# EAGLE design rgbwa_controller (EAGLE 7.1.0)
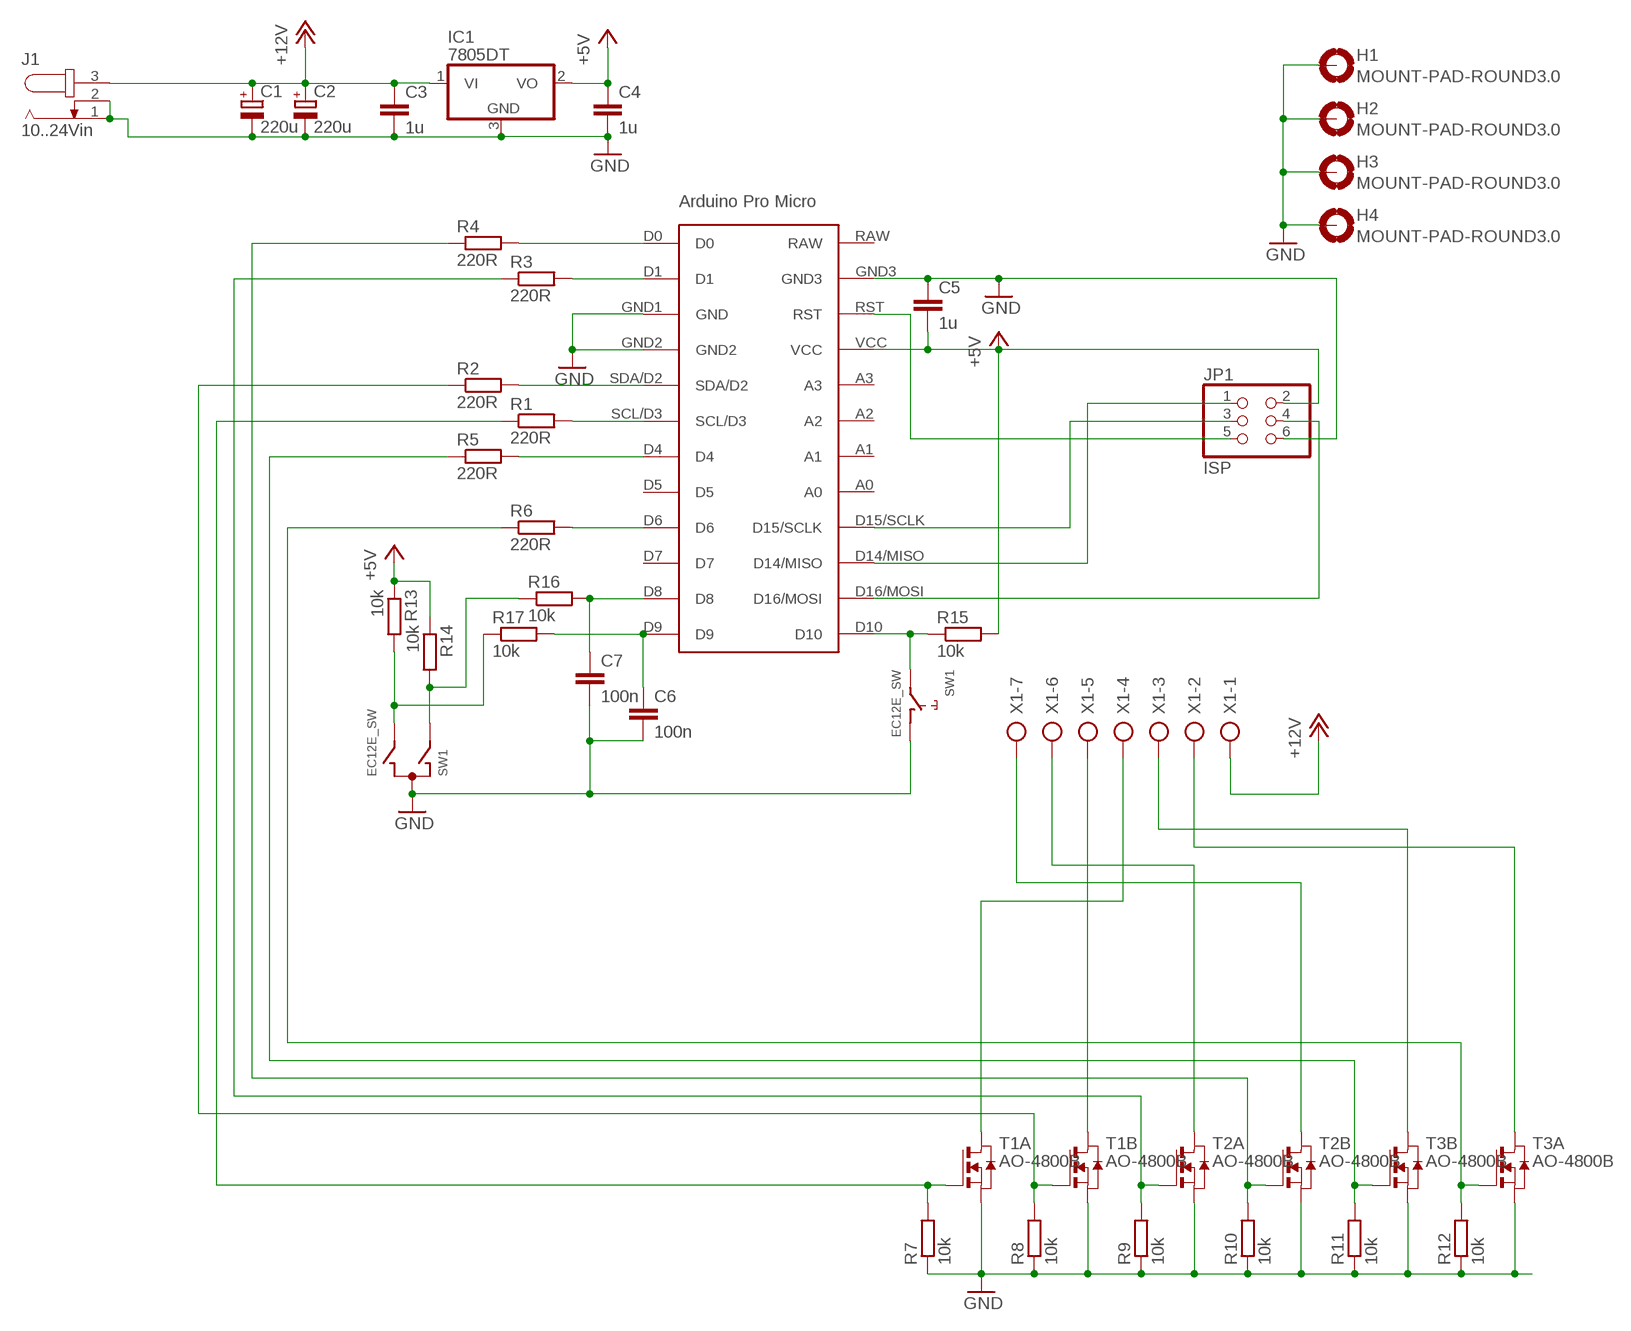
[diagram p0: schematic, sheet 1]

## Parts
C1  220u  CPOL-EU150CLZ-1010  [150CLZ-1010]
C2  220u  CPOL-EU150CLZ-1010  [150CLZ-1010]
C3  1u  C-EUC1206  [C1206]
C4  1u  C-EUC1206  [C1206]
C5  1u  C-EUC1206  [C1206]
C6  100n  C-EUC0805  [C0805]
C7  100n  C-EUC0805  [C0805]
H1  MOUNT-PAD-ROUND3.0  [3,0-PAD]
H2  MOUNT-PAD-ROUND3.0  [3,0-PAD]
H3  MOUNT-PAD-ROUND3.0  [3,0-PAD]
H4  MOUNT-PAD-ROUND3.0  [3,0-PAD]
IC1  7805DT  [TO252]
J1  10..24Vin  JACK-PLUG1  [SPC4078]
JP1  ISP  PINHD-2X3  [2X03]
R1  220R  R-EU_M0805  [M0805]
R2  220R  R-EU_M0805  [M0805]
R3  220R  R-EU_M0805  [M0805]
R4  220R  R-EU_M0805  [M0805]
R5  220R  R-EU_M0805  [M0805]
R6  220R  R-EU_M0805  [M0805]
R7  10k  R-EU_M0805  [M0805]
R8  10k  R-EU_M0805  [M0805]
R9  10k  R-EU_M0805  [M0805]
R10  10k  R-EU_M0805  [M0805]
R11  10k  R-EU_M0805  [M0805]
R12  10k  R-EU_M0805  [M0805]
R13  10k  R-EU_M0805  [M0805]
R14  10k  R-EU_M0805  [M0805]
R15  10k  R-EU_M0805  [M0805]
R16  10k  R-EU_M0805  [M0805]
R17  10k  R-EU_M0805  [M0805]
SW1  EC12E_SW  [ALPS_EC12E_SW]
T1  AO-4800B  NMOS2SM8  [SM8]
T2  AO-4800B  NMOS2SM8  [SM8]
T3  AO-4800B  NMOS2SM8  [SM8]
U$1  PROMICRO  [PROMICRO]
X1  AK300/7  [AK300/7]

## Nets
+5V: C4.1 C5.2 IC1.2(VO) JP1.2 R13.1 R14.1 R15.2 U$1.VCC
+12V: C1.+ C2.+ C3.1 IC1.1(VI) J1.3 X1.1
GND: C1.- C2.- C3.2 C4.2 C5.1 C6.2 C7.2 H1.B3,0(MOUNT) H2.B3,0(MOUNT) H3.B3,0(MOUNT) H4.B3,0(MOUNT) IC1.3(GND) J1.1 J1.2 JP1.6 R7.1 R8.1 R9.1 R10.1 R11.1 R12.1 SW1.C SW1.D T1.1(A:S) T1.3(B:S) T2.1(A:S) T2.3(B:S) T3.1(A:S) T3.3(B:S) U$1.GND1(GND) U$1.GND2 U$1.GND3
N$1: R4.2 U$1.D0
N$2: R3.2 U$1.D1
N$3: R2.2 U$1.SDA/D2
N$4: R1.2 U$1.SCL/D3
N$5: R5.2 U$1.D4
N$6: R6.2 U$1.D6
N$7: R1.1 R7.2 T1.2(A:G)
N$8: R2.1 R8.2 T1.4(B:G)
N$9: R3.1 R9.2 T2.2(A:G)
N$10: R4.1 R10.2 T2.4(B:G)
N$11: R5.1 R11.2 T3.4(B:G)
N$12: R6.1 R12.2 T3.2(A:G)
N$13: R13.2 R17.1 SW1.B
N$14: JP1.1 U$1.D14/MISO
N$15: T3.7(A:D) T3.8(A:D) X1.2
N$16: T1.5(B:D) T1.6(B:D) X1.5
N$17: T1.7(A:D) T1.8(A:D) X1.4
N$20: R14.2 R16.1 SW1.A
N$21: JP1.3 U$1.D15/SCLK
N$22: C6.1 R17.2 U$1.D9
N$23: R15.1 SW1.E U$1.D10
N$24: C7.1 R16.2 U$1.D8
N$25: JP1.5 U$1.RST
N$26: T3.5(B:D) T3.6(B:D) X1.3
N$27: T2.5(B:D) T2.6(B:D) X1.7
N$28: T2.7(A:D) T2.8(A:D) X1.6
N$29: JP1.4 U$1.D16/MOSI
Unconnected: SW1.GND1(G) SW1.GND2(G) U$1.A0 U$1.A1 U$1.A2 U$1.A3 U$1.D5 U$1.D7 U$1.RAW

## Library data of the parts
C1 C2 = rcl:CPOL-EU: POLARIZED CAPACITOR, European symbol
C3-C7 = rcl:C-EU: CAPACITOR, European symbol
H1-H4 = holes:MOUNT-PAD-ROUND: MOUNTING PAD, round
IC1 = linear:78*: Positive VOLTAGE REGULATOR Source: http://cache.national.com/ds/LM/LM78L05.pdf http://www.fairchildsemi.com/ds/LM/LM7805.pdf
J1 = con-jack:JACK-PLUG: DC POWER JACK Power Jack, DC, Right Angle, Through Hole, Rated 5A at 16VDC, PC Terminals Distributor: Farnell (www.Farnell.de) Drawing: 84N1161.pdf / 84N1162.pdf Manufacturer: SPC Technology (www.spctechnology.com) Type: SPC4077 / SPC 4078; OC_FARNELL: unknown; OC_NEWARK: unknown
JP1 = pinhead:PINHD-2X3: PIN HEADER
R1-R17 = rcl:R-EU_: RESISTOR, European symbol
SW1 = switch-alps:EC12E_SW: ALPS rotary Encoder EC12E series with switch; MPN: EC12E2424407; OC_FARNELL: 1520813; OC_NEWARK: 74M1068
T1-T3 = zetex:NMOS2SM8: Dual MOS FET; OC_FARNELL: unknown; OC_NEWARK: unknown
U$1 = arduino pro micro:PROMICRO
X1 = con-ptr500:AK300/7: CONNECTOR; OC_FARNELL: unknown; OC_NEWARK: unknown

## Board
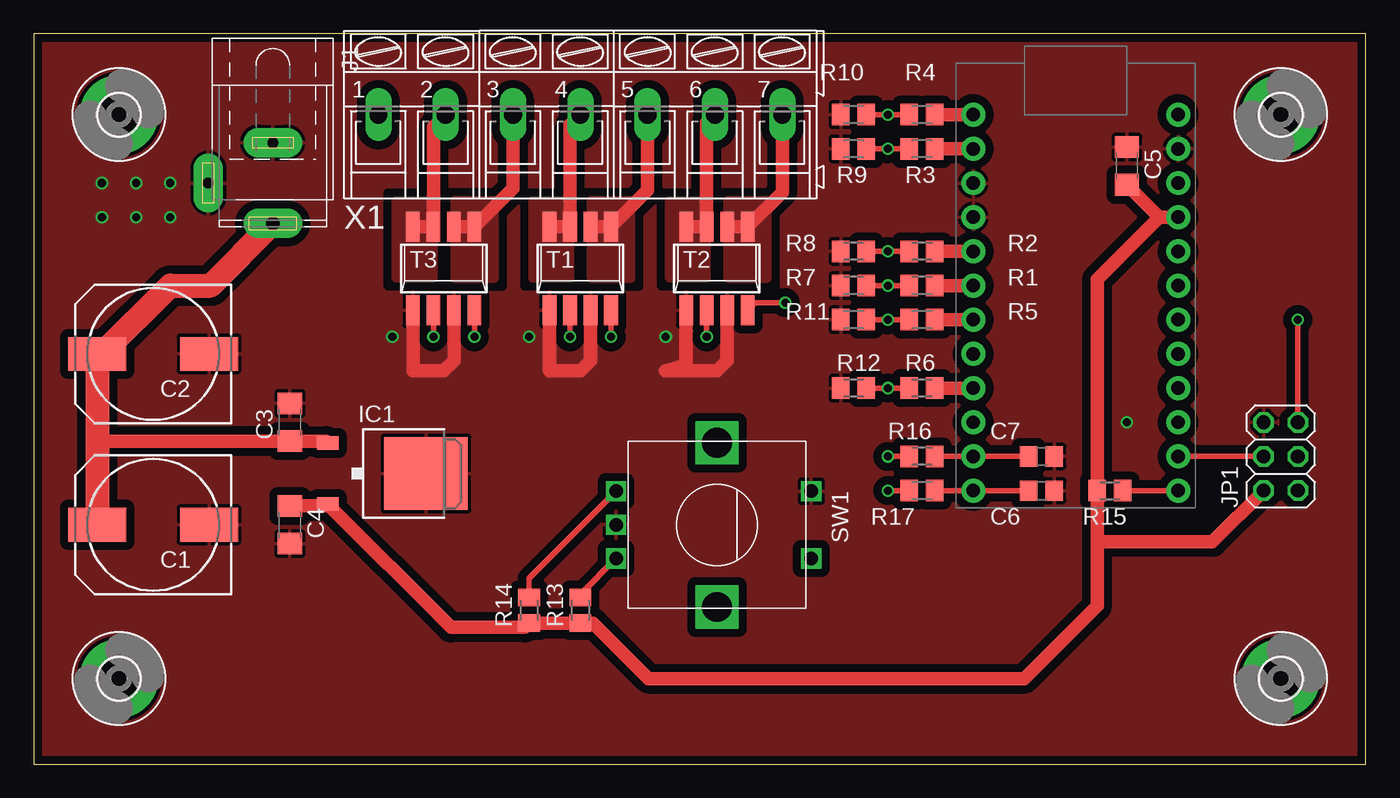
[diagram p1: board, top side]
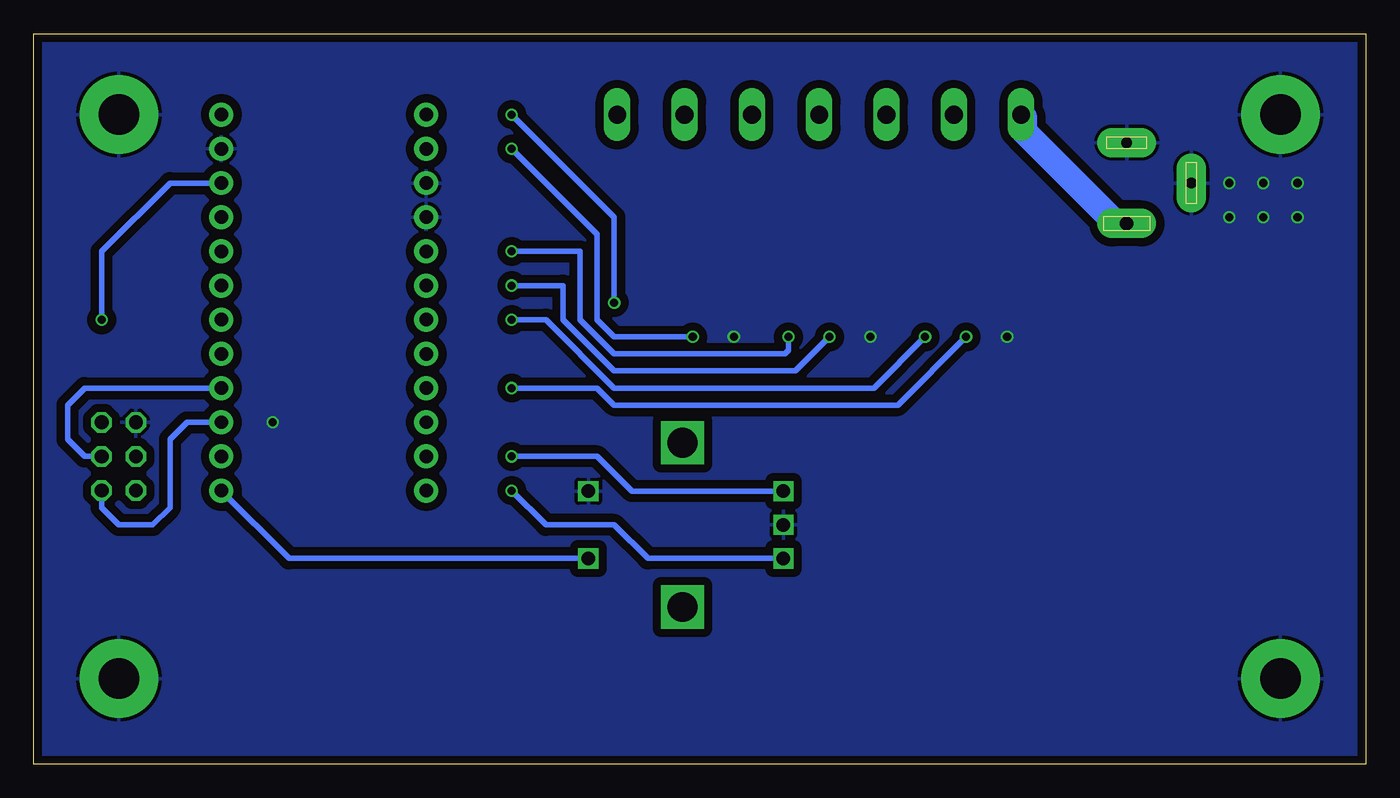
[diagram p2: board, bottom side, seen from below]

Size 99.04 x 54.28 mm. Coordinates in mm from the lower left corner, seen from the top.
Outline: 0,0 99.04,0 99.04,54.28 0,54.28 0,0
Copper layers (1*16): Top 0.035mm / dielectric 1.5mm / Bottom 0.035mm
Design rules "dirt_cheap_dirty_boards.v1": minimum track width 5mil, minimum drill 12mil, track to track 5mil, track to pad 5mil, pad to pad 5mil, via to via 5mil, smd to smd 0mil, copper to edge 10mil, drill to drill 10mil, minimum pad ring 10mil, minimum via ring 6mil, stop-mask expansion 2mil, vias tented up to drill 25mil, thermal gap 10mil

### Footprints (pad centres in the part's own frame; a part is rotated, then mirrored left to right if it is on the bottom)
150CLZ-1010 = smd 4.3 x 2.5: + 4.15,0; - -4.15,0
C1206 = smd 1.6 x 1.8: 1 -1.4,0; 2 1.4,0
C0805 = smd 1.3 x 1.5: 1 -0.95,0; 2 0.95,0
3,0-PAD = drill 3 pad 5.842: B3,0 0,0
TO252 = smd 1 x 1.6: 1 -2.28,-4.8; 2 2.28,-4.8 | smd 5.4 x 6.2: 3 0,2.5
SPC4078 = drill 0.8 pad 2.184 long: 1 -3,0; 2 0,-4.8 | drill 1 pad 2.184 long: 3 3,0
2X03 = drill 1.016 octagon: 1 -2.54,-1.27; 2 -2.54,1.27; 3 0,-1.27; 4 0,1.27; 5 2.54,-1.27; 6 2.54,1.27
M0805 = smd 1.3 x 1.6: 1 -0.95,0; 2 0.95,0
ALPS_EC12E_SW = drill 1 square: A -2.5,-7.5; B 2.5,-7.5; C 0,-7.5; D -2.5,7; E 2.5,7 | drill 2.2 square: GND1 -6.1,0; GND2 6.1,0
SM8 = smd 1.016 x 2.235: 1 -2.286,-3.099; 2 -0.762,-3.099; 3 0.762,-3.099; 4 2.286,-3.099; 5 2.286,3.099; 6 0.762,3.099; 7 -0.762,3.099; 8 -2.286,3.099
PROMICRO = drill 1 pad 1.778: A0 16.51,8.89; A1 16.51,11.43; A2 16.51,13.97; A3 16.51,16.51; D0 1.27,26.67; D1 1.27,24.13; D4 1.27,11.43; D5 1.27,8.89; D6 1.27,6.35; D7 1.27,3.81; D8 1.27,1.27; D9 1.27,-1.27; D10 16.51,-1.27; D14/MISO 16.51,3.81; D15/SCLK 16.51,6.35; D16/MOSI 16.51,1.27; GND1 1.27,21.59; GND2 1.27,19.05; GND3 16.51,24.13; RAW 16.51,26.67; RST 16.51,21.59; SCL/D3 1.27,13.97; SDA/D2 1.27,16.51; VCC 16.51,19.05
AK300/7 = drill 1.321 long: 1 -15.011,0; 2 -10.008,0; 3 -5.004,0; 4 0,0; 5 5.004,0; 6 10.008,0; 7 15.011,0

### Placement (x,y rotation side)
C1  8.89,17.78 180 top
C2  8.89,30.48 180 top
C3  19.05,25.4 90 top
C4  19.05,17.78 270 top
C5  81.28,44.45 270 top
C6  74.93,20.32 0 top
C7  74.93,22.86 0 top
H1  6.35,48.26 0 top
H2  92.71,48.26 0 top
H3  92.71,6.35 0 top
H4  6.35,6.35 0 top
IC1  26.67,21.59 270 top
J1  17.78,43.18 270 top
JP1  92.71,22.86 90 top
R1  66.04,35.56 0 top
R2  66.04,38.1 0 top
R3  66.04,45.72 0 top
R4  66.04,48.26 0 top
R5  66.04,33.02 0 top
R6  66.04,27.94 0 top
R7  60.96,35.56 0 top
R8  60.96,38.1 0 top
R9  60.96,45.72 0 top
R10  60.96,48.26 0 top
R11  60.96,33.02 0 top
R12  60.96,27.94 0 top
R13  40.64,11.43 90 top
R14  36.83,11.43 90 top
R15  80.01,20.32 180 top
R16  66.04,22.86 0 top
R17  66.04,20.32 0 top
SW1  50.8,17.78 270 top
T1  40.64,36.83 0 top
T2  50.8,36.83 0 top
T3  30.48,36.83 0 top
U$1  68.58,21.59 0 top
X1  40.64,48.26 0 top

### Tracks (layer width: path | path; a pad name or v marks a point on that pad's centre or on a via)
+5V
  Top 1.016: C5.2 83.69,40.64 | 83.69,40.64 U$1.VCC | 83.69,40.64 79.06,36.01 R15.2 79.06,16.51 | C4.1 21.74,19.18 IC1.2 31.02,10.16 36.51,10.16 R14.1 R13.1 41.59,10.48 45.72,6.35 73.66,6.35 79.06,11.75 79.06,16.51 | JP1.2 87.63,16.51 79.06,16.51
+12V
  Top 1.016: 4.74,24.13 4.87,24 C3.1 21.74,24 IC1.1
  Top 1.778: C1.+ 4.74,24.13 C2.+ 5.08,30.48 10.16,35.56 13.16,35.56 J1.3
  Top 1.93: X1.1 25.63,48.03
  Bottom 1.93: J1.3 18.59,40.18 25.4,46.99 25.4,48.03 X1.1
GND  (via drill 0.6)
  Top 1.016: T3.1 28.19,29.21 30.48,29.21 31.24,29.97 T3.3 | T1.1 38.35,29.21 40.64,29.21 41.4,29.97 T1.3 | T2.1 48.51,29.67 46.99,29.21 50.8,29.21 51.56,29.97 T2.3
  other vias: 5.08,43.18 5.08,40.64 7.62,43.18 7.62,40.64 10.16,43.18 10.16,40.64 26.67,31.75 36.83,31.75 46.99,31.75 81.28,25.4
  pour Top (isolate 0.61, rank 2): 0,54.61 99.06,54.61 99.06,0 0,0
  pour Bottom (isolate 0.61, rank 2): 0,54.61 99.06,54.61 99.06,0 0,0
N$1
  Top 1.016: R4.2 U$1.D0
N$2
  Top 1.016: U$1.D1 R3.2
N$3
  Top 1.016: R2.2 U$1.SDA/D2
N$4
  Top 1.016: U$1.SCL/D3 R1.2
N$5
  Top 1.016: R5.2 U$1.D4
N$6
  Top 1.016: U$1.D6 R6.2
N$7  (via drill 0.6)
  Top 0.406: R1.1 v63.5,35.56 R7.2 | v39.88,31.75 T1.2
  Bottom 0.406: v63.5,35.56 59.69,35.56 59.69,33.02 55.88,29.21 42.42,29.21 v39.88,31.75
N$8  (via drill 0.6)
  Top 0.406: R2.1 v63.5,38.1 R8.2 | v42.93,31.75 T1.4
  Bottom 0.406: v63.5,38.1 58.42,38.1 58.42,33.02 55.88,30.48 43.18,30.48 42.93,30.73 v42.93,31.75
N$9  (via drill 0.6)
  Top 0.406: R3.1 v63.5,45.72 R9.2 | v50.04,31.75 T2.2
  Bottom 0.406: v63.5,45.72 57.15,39.37 57.15,33.02 55.88,31.75 v50.04,31.75
N$10  (via drill 0.6)
  Top 0.406: R4.1 v63.5,48.26 R10.2 | v55.88,34.29 53.65,34.29 T2.4
  Bottom 0.406: v63.5,48.26 55.88,40.64 v55.88,34.29
N$11  (via drill 0.6)
  Top 0.406: R5.1 v63.5,33.02 R11.2 | v32.77,31.75 T3.4
  Bottom 0.406: v63.5,33.02 60.96,33.02 55.88,27.94 36.58,27.94 v32.77,31.75
N$12  (via drill 0.6)
  Top 0.406: R6.1 v63.5,27.94 R12.2 | v29.72,31.75 T3.2
  Bottom 0.406: v63.5,27.94 57.15,27.94 55.88,26.67 34.8,26.67 v29.72,31.75
N$13  (via drill 0.6)
  Top 0.406: v63.5,20.32 R17.1 | R13.2 40.64,12.62 SW1.B
  Bottom 0.406: SW1.B 53.38,15.28 55.88,17.78 60.96,17.78 v63.5,20.32
N$14
  Bottom 0.406: JP1.1 93.98,19.05 92.71,17.78 90.17,17.78 88.9,19.05 88.9,24.13 87.63,25.4 U$1.D14/MISO
N$15
  Top 1.016: T3.8 T3.7 29.72,47.35 X1.2
  pour Top (isolate 0.406, no thermals): 26.92,41.91 29.72,41.91 29.72,36.07 26.92,36.07
N$16
  Top 1.016: T1.6 T1.5 45.64,42.65 X1.5
  pour Top (isolate 0.406, no thermals): 41.4,41.91 41.4,36.07 44.45,36.07 44.45,41.91
N$17
  Top 1.016: T1.8 T1.7 39.88,47.5 X1.4
  pour Top (isolate 0.406, no thermals): 37.08,41.91 39.88,41.91 39.88,36.07 37.08,36.07
N$20  (via drill 0.6)
  Top 0.406: v63.5,22.86 R16.1 | R14.2 36.83,13.81 SW1.A
  Bottom 0.406: SW1.A 54.57,20.28 57.15,22.86 v63.5,22.86
N$21
  Bottom 0.406: JP1.3 95.25,22.86 96.52,24.13 96.52,26.67 95.25,27.94 U$1.D15/SCLK
N$22
  Top 0.406: C6.1 U$1.D9 R17.2
N$23
  Top 0.406: R15.1 U$1.D10
  Bottom 0.406: SW1.E 80.05,15.28 U$1.D10
N$24
  Top 0.406: C7.1 U$1.D8 R16.2
N$25  (via drill 0.6)
  Top 0.406: JP1.5 v93.98,33.02
  Bottom 0.406: v93.98,33.02 93.98,38.1 88.9,43.18 U$1.RST
N$26
  Top 1.016: T3.6 T3.5 35.64,42.8 X1.3
  pour Top (isolate 0.406, no thermals): 31.24,41.91 31.24,36.07 34.29,36.07 34.29,41.91
N$27
  Top 1.016: T2.6 T2.5 55.65,42.49 X1.7
  pour Top (isolate 0.406, no thermals): 51.56,41.91 51.56,36.07 54.61,36.07 54.61,41.91
N$28
  Top 1.016: T2.8 T2.7 50.04,47.65 X1.6
  pour Top (isolate 0.406, no thermals): 47.24,41.91 50.04,41.91 50.04,36.07 47.24,36.07
N$29
  Top 0.406: JP1.4 U$1.D16/MOSI